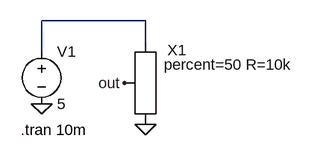
[diagram p0: schematic potentionmeter_block.asc]
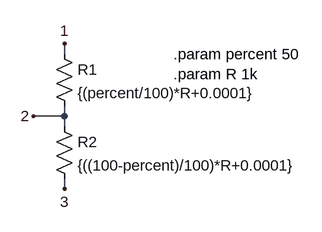
[diagram p1: sub-circuit potentionmeter.asc]
potentionmeter_block.asc, the LTspice schematic file:
Version 4
SHEET 1 1824 680
WIRE 224 -368 64 -368
WIRE 224 -336 224 -368
WIRE 64 -320 64 -368
FLAG 64 -240 0
FLAG 224 -208 0
FLAG 192 -272 out
SYMBOL voltage 64 -336 R0
SYMATTR InstName V1
SYMATTR Value 5
SYMBOL potentionmeter 208 -320 R90
WINDOW 0 -3 -79 VRight 2
WINDOW 39 20 -244 VRight 2
SYMATTR InstName X1
SYMATTR SpiceLine percent=50 R=10k
TEXT 32 -200 Left 2 !.tran 10m

potentionmeter.asc, the sub-circuit schematic file:
Version 4
SHEET 1 1824 680
WIRE 240 -416 240 -432
WIRE 240 -320 240 -336
WIRE 240 -320 192 -320
WIRE 240 -304 240 -320
WIRE 240 -208 240 -224
FLAG 240 -432 1
FLAG 192 -320 2
FLAG 240 -208 3
SYMBOL res 224 -432 R0
SYMATTR InstName R1
SYMATTR Value {(percent/100)*R+0.0001}
SYMBOL res 224 -320 R0
SYMATTR InstName R2
SYMATTR Value {((100-percent)/100)*R+0.0001}
TEXT 408 -416 Left 2 !.param percent 50\n.param R 1k

The netlist it stands for:
* potentionmeter_block.asc
V1 N001 0 5
XX1 N001 out 0 potentionmeter params: percent=50 R=10k

* block symbol definitions
.subckt potentionmeter 1 2 3
R1 1 2 {(percent/100)*R+0.0001}
R2 2 3 {((100-percent)/100)*R+0.0001}
.param percent 50
.param R 1k
.ends potentionmeter

.tran 10m
.backanno
.end